# EAGLE design ADNS-9500 (EAGLE 5.11)
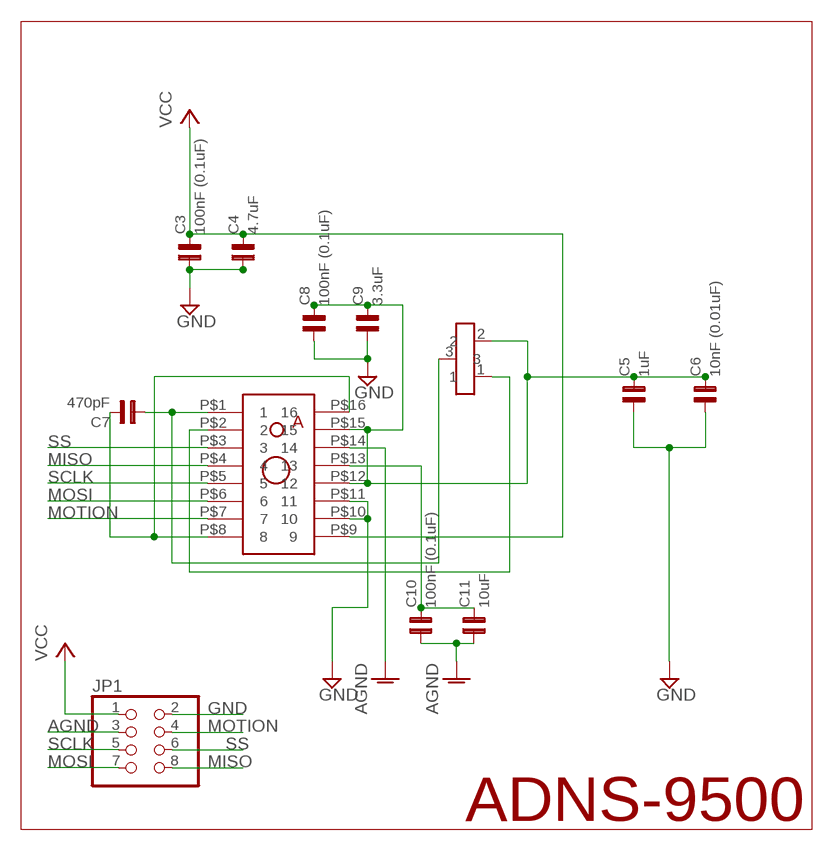
[diagram p0: schematic, sheet 1]

## Parts
C3  100nF (0.1uF)  C0603  [0603]
C4  4.7uF  C0805  [0805]
C5  1uF  C0805  [0805]
C6  10nF (0.01uF)  C0603  [0603]
C7  470pF  C0603  [0603]
C8  100nF (0.1uF)  C0603  [0603]
C9  3.3uF  C0805  [0805]
C10  100nF (0.1uF)  C0603  [0603]
C11  10uF  C0805  [0805]
JP1  PINHD-2X4  [2X04]
Q1  TRANSISTOR_SC-75  [SC-75_TRANSISTOR]
U$1  AVAGO_ADNS-9500  [AVAGO_ADNS-9500]

## Nets
AGND: C10.1 C11.1 JP1.3 U$1.P$14
GND: C3.1 C4.1 C5.1 C6.1 C8.1 C9.1 JP1.2 U$1.P$10 U$1.P$11
MISO: JP1.8 U$1.P$4
MOSI: JP1.7 U$1.P$6
MOTION: JP1.4 U$1.P$7
N$1: Q1.1 U$1.P$2
N$2: C7.1 Q1.3 U$1.P$1
N$3: C5.2 C6.2 C8.2 C9.2 Q1.2 U$1.P$12 U$1.P$15
N$4: C7.2 U$1.P$8 U$1.P$16
N$7: C10.2 C11.2 U$1.P$13
SCLK: JP1.5 U$1.P$5
SS: JP1.6 U$1.P$3
VCC: C3.2 C4.2 JP1.1 U$1.P$9

## Notes on the sheet
- ADNS-9500

## Library data of the parts
C3 C6-C8 C10 = capsmd:C0603
C4 C5 C9 C11 = capsmd:C0805
JP1 = pinhead:PINHD-2X4: PIN HEADER
Q1 = JKCustom:TRANSISTOR_SC-75: SC-75 Package
U$1 = JKCustom:AVAGO_ADNS-9500

## Board
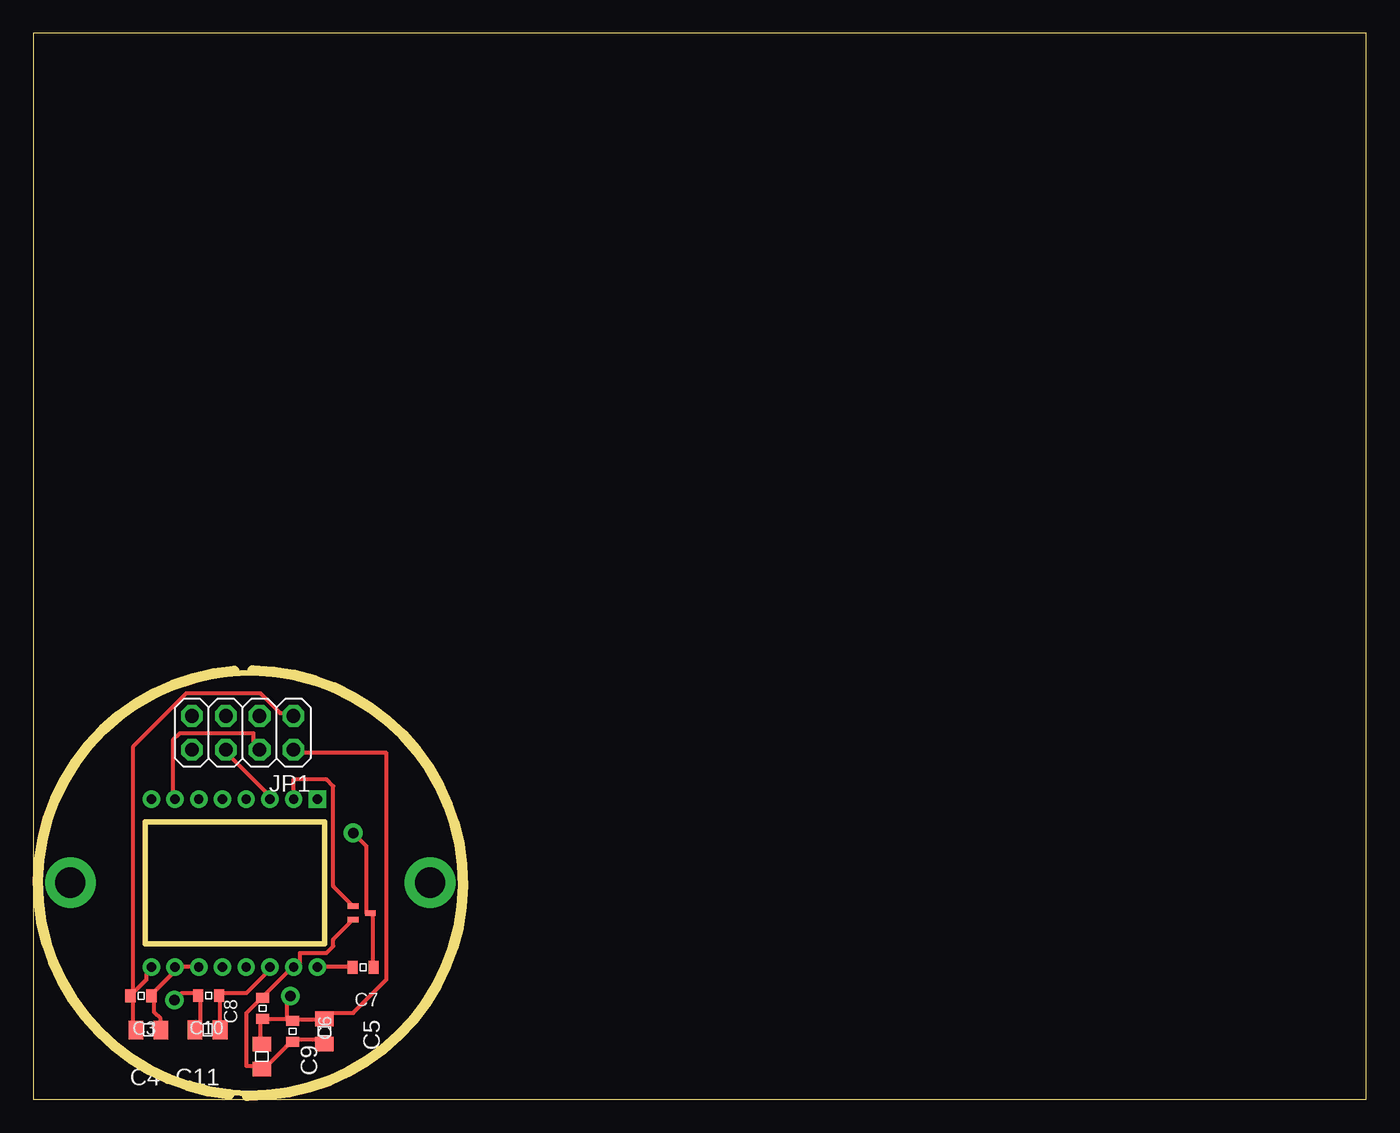
[diagram p1: board, top side]
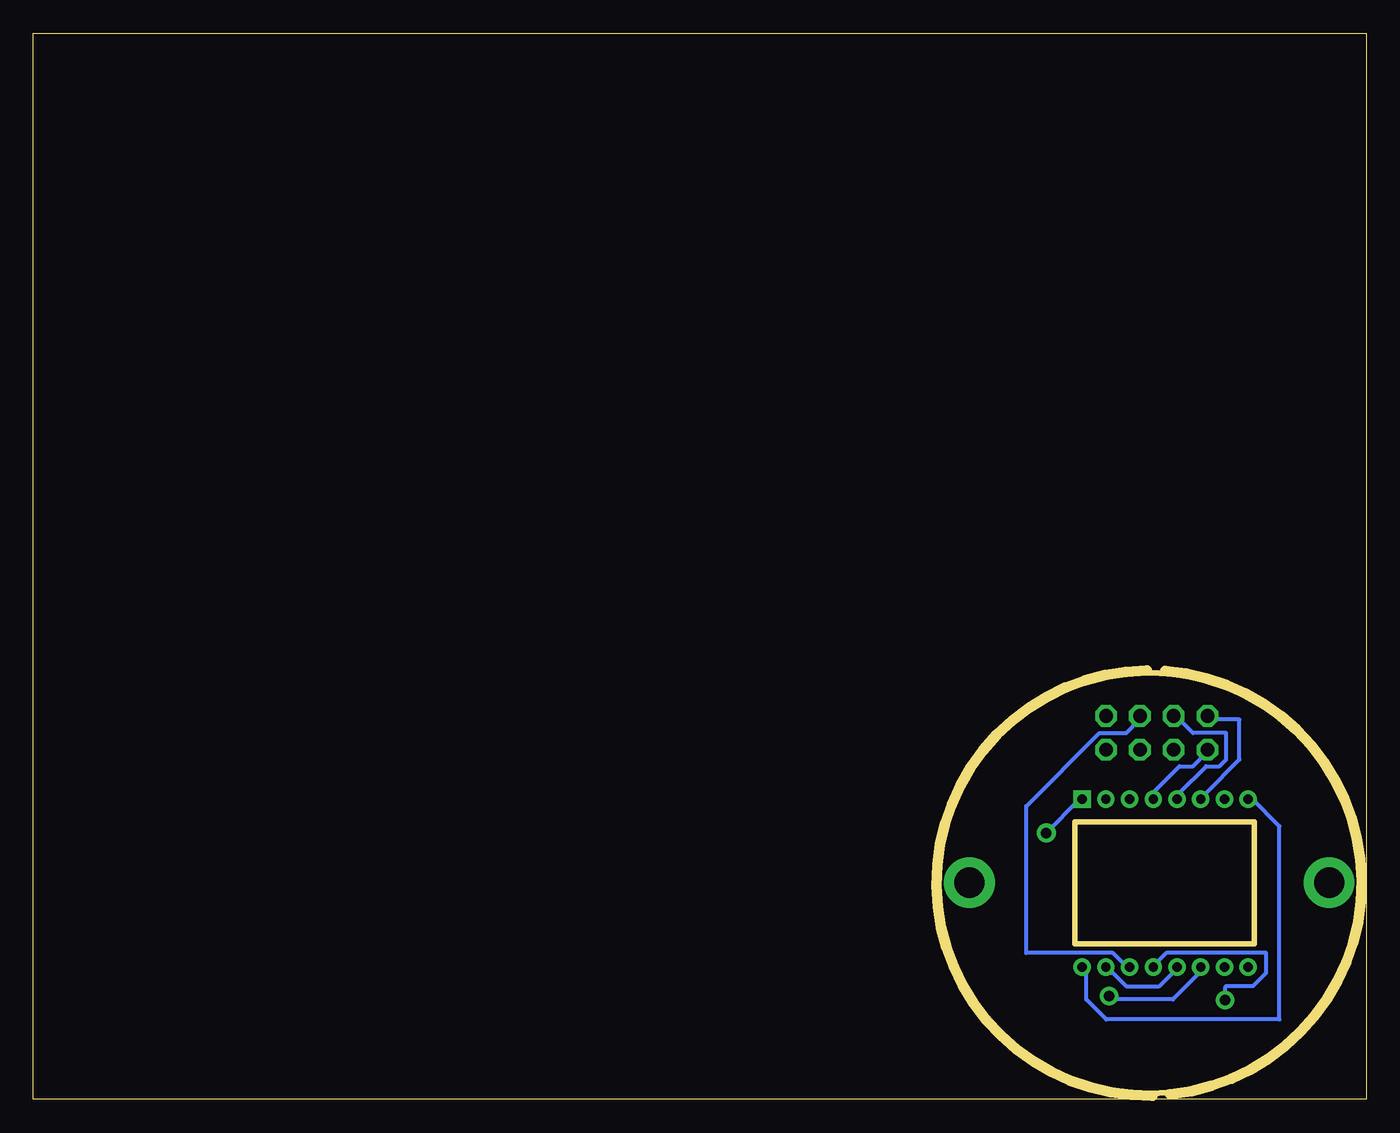
[diagram p2: board, bottom side, seen from below]

Size 100 x 80 mm. Coordinates in mm from the lower left corner, seen from the top.
Outline: 0,0 100,0 100,80 0,80 0,0
Outline: circle at 16.29,16.23 radius 15.76
Copper layers (1*16): Top 0.035mm / dielectric 1.5mm / Bottom 0.035mm
Design rules "default *": minimum track width 12mil, minimum drill 0.7938mm, track to track 10mil, track to pad 10mil, pad to pad 10mil, via to via 10mil, smd to smd 10mil, copper to edge 10mil, drill to drill 10mil, minimum pad ring 12mil, minimum via ring 12mil, stop-mask expansion 12mil, vias tented up to drill 0mil, thermal gap 12mil
Milling: 6 lines

### Footprints (pad centres in the part's own frame; a part is rotated, then mirrored left to right if it is on the bottom)
0603 = smd 0.762 x 0.965: 1 -0.787,0; 2 0.787,0
0805 = smd 1.092 x 1.397: 1 -0.94,0; 2 0.94,0
2X04 = drill 1.016 octagon: 1 -3.81,-1.27; 2 -3.81,1.27; 3 -1.27,-1.27; 4 -1.27,1.27; 5 1.27,-1.27; 6 1.27,1.27; 7 3.81,-1.27; 8 3.81,1.27
SC-75_TRANSISTOR = smd 0.406 x 0.813: 1 0.2,0.4; 2 1.2,0.4; 3 0.7,1.7
AVAGO_ADNS-9500 = drill 0.7 pad 1.3 square: P$1 0,0 | drill 0.7 pad 1.3 round: P$2 -1.78,0; P$3 -3.56,0; P$4 -5.34,0; P$5 -7.12,0; P$6 -8.9,0; P$7 -10.68,0; P$8 -12.46,0; P$9 -12.46,-12.6; P$10 -10.68,-12.6; P$11 -8.9,-12.6; P$12 -7.12,-12.6; P$13 -5.34,-12.6; P$14 -3.56,-12.6; P$15 -1.78,-12.6; P$16 0,-12.6

### Placement (x,y rotation side)
C3  8.08,7.77 180 top
C4  8.65,5.22 180 top
C5  21.85,5.12 270 top
C6  19.46,5.12 270 top
C7  24.75,9.91 180 top
C8  17.21,6.85 90 top
C9  17.15,3.21 270 top
C10  13.15,7.8 180 top
C11  13.08,5.23 180 top
JP1  15.71,27.51 180 top
Q1  23.59,14.7 270 top
U$1  21.31,22.54 0 top

### Tracks (layer width: path | path; a pad name or v marks a point on that pad's centre or on a via)
AGND
  Top 0.305: C11.1 14,5.5 14,7.5 C10.1 14,8 16,8 17.5,9.5 U$1.P$14
  Bottom 0.305: JP1.3 17,28.5 18,27.5 20,27.5 25.5,22 25.5,11 19,11 18,10 U$1.P$14
GND  (via drill 0.79)
  Top 0.305: C4.1 9,5.5 | U$1.P$11 12,10 11,10 U$1.P$10 10.5,9.5 9,8 C3.1 9,7.5 | 19,6 17.5,6 C8.1 17,6 17,4.5 C9.1 | JP1.2 20,26 26.5,26 26.5,9 24,6.5 22,6.5 C5.1 21.5,6 19.5,6 C6.1 19,6 | 9.08,7.5 9.08,6.51 9.1,6.51 9.54,6.07 9.54,5.27 | 19,7.47 19,6
  Top 0.406: 9.08,7.5 9,7.5 | C4.1 9.54,5.27 | v19.3,7.76 19,7.47
  Bottom 0.305: U$1.P$11 12.5,9.5 14.5,7.5 19.04,7.5
  Bottom 0.406: 19.04,7.5 v19.3,7.76
MISO
  Bottom 0.305: U$1.P$4 16,23 14,25 13,25 12,26 JP1.8
MOSI
  Bottom 0.305: U$1.P$6 12,23 9.5,25.5 9.5,28.5 11.5,28.5 JP1.7
MOTION
  Top 0.305: U$1.P$7 10.5,23 10.5,27 11,27.5 16.5,27.5 16.5,26.5 JP1.4
N$1
  Top 0.305: Q1.1 22.5,16 22.5,23.5 22,24 19.5,24 19.5,23 U$1.P$2
N$2  (via drill 0.79)
  Top 0.305: C7.1 25.5,10 25.5,14 Q1.3 25,14 25,19 v24,20
  Bottom 0.305: v24,20 21.5,22.5 U$1.P$1
N$3
  Top 0.305: C5.2 21.5,4.5 19.5,4.5 C6.2 19,4 17.5,2.5 C9.2 17,2.5 16,2.5 16,6.5 17,7.5 C8.2 17.5,8 19.5,10 U$1.P$15 20,10 20,11 22,11 22.5,11.5 22.5,12 Q1.2
  Bottom 0.305: U$1.P$12 14.5,9.5 15.5,8.5 18,8.5 19,9.5 19.5,9.5 U$1.P$15
N$4
  Top 0.305: C7.2 24,10 21.5,10 U$1.P$16
  Bottom 0.305: U$1.P$8 8.5,22.5 6.5,20.5 6.5,6 19.5,6 21,7.5 21,9.5 U$1.P$16
N$5  (via drill 2.26 pad 3.81)
  other vias: 29.77,16.27
N$6  (via drill 2.26 pad 3.81)
  other vias: 2.78,16.27
N$7  (via drill 0.79)
  Top 0.305: C11.2 12.5,5.5 12.5,7.5 C10.2 12,8 11.14,8 v10.6,7.45
  Bottom 0.305: U$1.P$13 16,10 15,11 7.5,11 7.5,9.5 8.5,8.5 10.5,8.5 10.6,8.4 v10.6,7.45
SCLK
  Bottom 0.305: U$1.P$5 14,23 12,25 11,25 10.5,25.5 10.5,27.5 13,27.5 14,28.5 JP1.5
SS
  Top 0.305: U$1.P$3 17.5,23 14.5,26 JP1.6
VCC
  Top 0.305: 7.5,8 8.5,9 8.5,9.5 U$1.P$9 | 7.5,8 7.5,26.5 11.5,30.5 17,30.5 18.5,29 19.5,29 JP1.1 | 7.5,8 C3.2 7.5,7.5 7.5,5.43 | C4.2 7.5,5.5
  Top 0.406: 7.5,5.43 C4.2